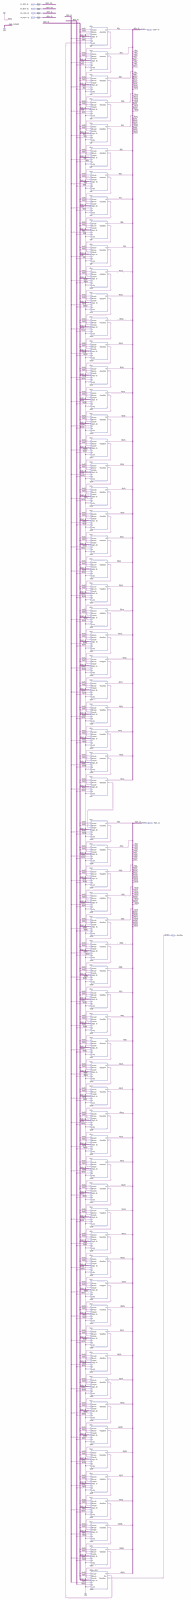
[diagram p0: schematic sheet, whole]
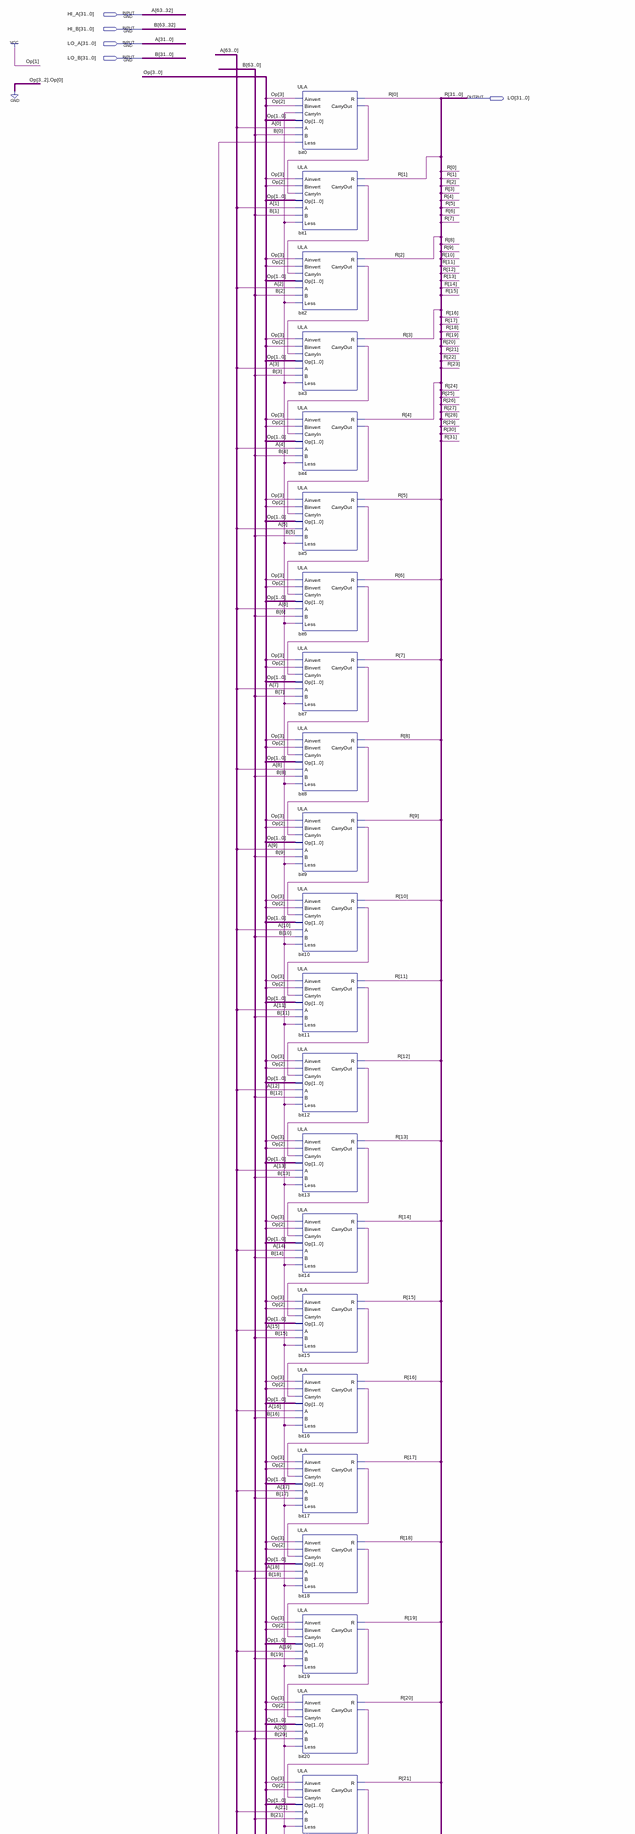
[diagram p1: schematic sheet, upper part]
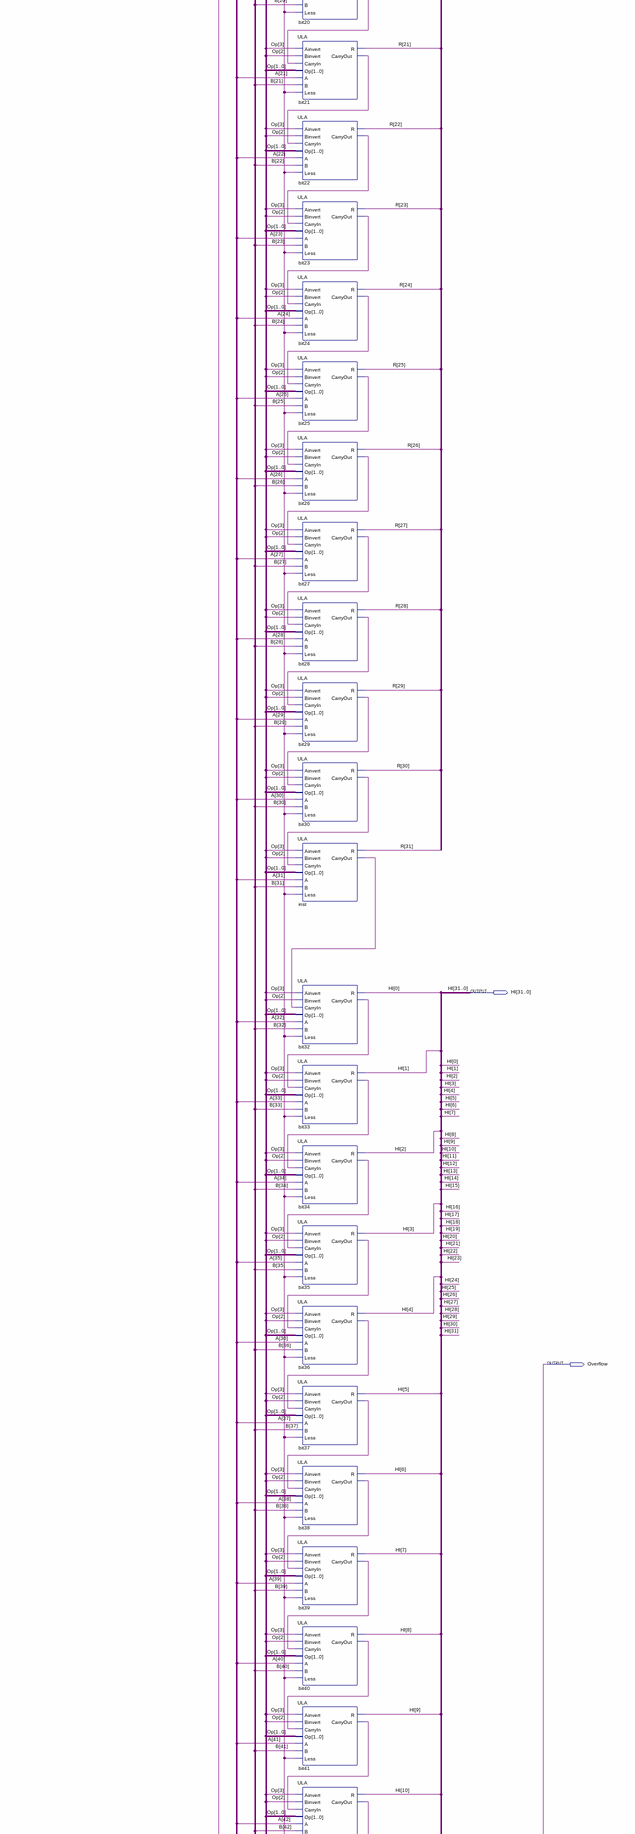
[diagram p2: schematic sheet, middle part]
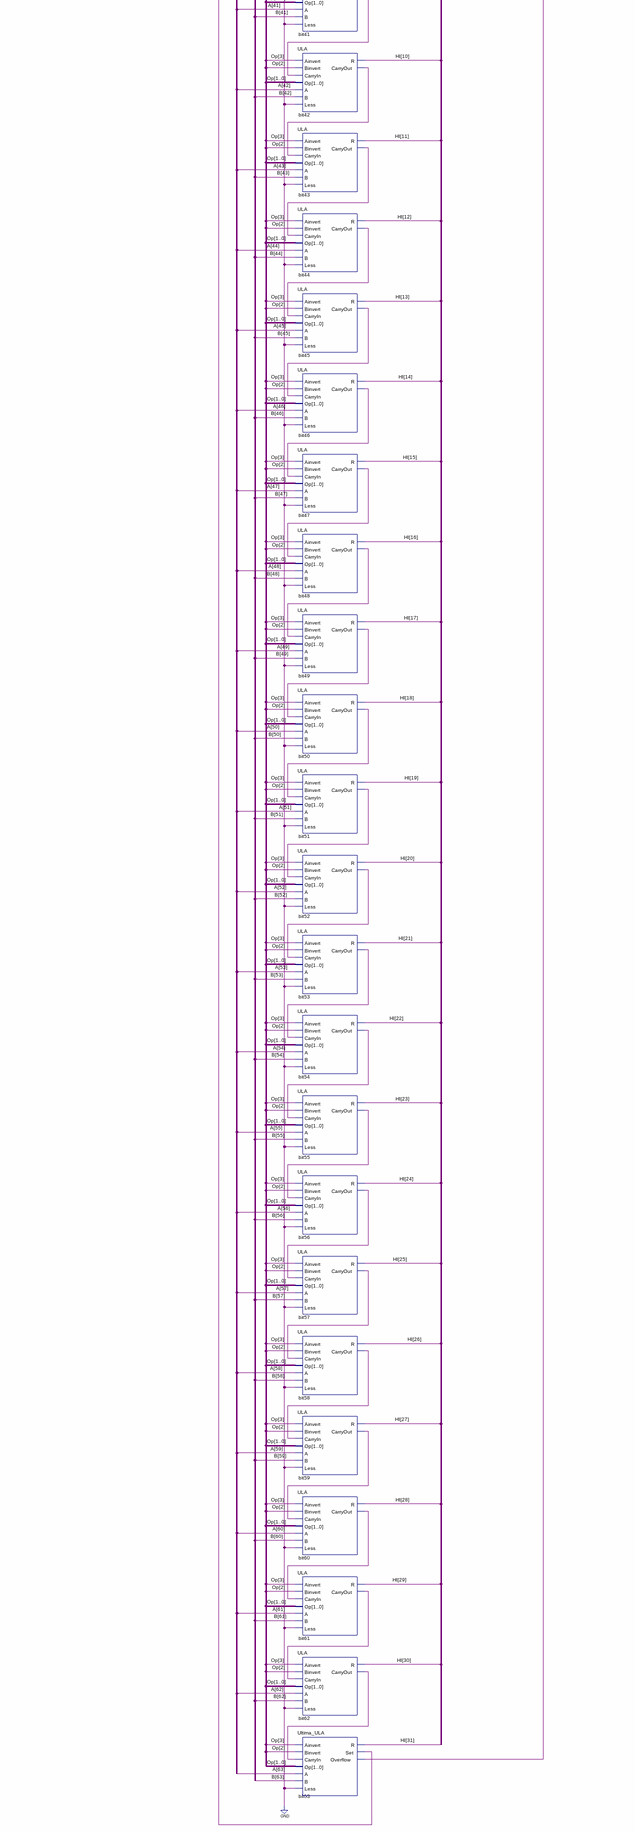
[diagram p3: schematic sheet, lower part]
// Quartus schematic ULA64.bdf as structural Verilog: 64 symbols, 7 pins
module ULA64 (
  input  [31:0] HI_A,
  input  [31:0] HI_B,
  input  [31:0] LO_A,
  input  [31:0] LO_B,
  output [31:0] LO,
  output [31:0] HI,
  output Overflow
);

  wire bit0_carryout, bit1_carryout, bit2_carryout, bit3_carryout, bit4_carryout, bit5_carryout,
       bit6_carryout, bit7_carryout, bit8_carryout, bit9_carryout, bit10_carryout, bit11_carryout,
       bit12_carryout, bit13_carryout, bit14_carryout, bit15_carryout, bit16_carryout, bit17_carryout,
       bit18_carryout, bit19_carryout, bit20_carryout, bit21_carryout, bit22_carryout, bit23_carryout,
       bit24_carryout, bit25_carryout, bit26_carryout, bit27_carryout, bit28_carryout, bit29_carryout,
       bit30_carryout, bit32_carryout, bit33_carryout, bit34_carryout, bit35_carryout, bit36_carryout,
       bit37_carryout, bit38_carryout, bit39_carryout, bit40_carryout, bit41_carryout, bit42_carryout,
       bit43_carryout, bit44_carryout, bit45_carryout, bit46_carryout, bit47_carryout, bit48_carryout,
       bit49_carryout, bit50_carryout, bit51_carryout, bit52_carryout, bit53_carryout, bit54_carryout,
       bit55_carryout, bit56_carryout, bit57_carryout, bit58_carryout, bit59_carryout, bit60_carryout,
       bit61_carryout, bit62_carryout, bit63_set, inst_carryout;

  ULA bit0 (
    .Ainvert(1'b0), .Binvert(1'b0), .CarryIn(1'b0), .Op(2'b10), .A(LO_A[0]), .B(LO_B[0]), .Less(bit63_set),
    .R(LO[0]), .CarryOut(bit0_carryout));
  ULA bit1 (
    .Ainvert(1'b0), .Binvert(1'b0), .CarryIn(bit0_carryout), .Op(2'b10), .A(LO_A[1]), .B(LO_B[1]),
    .Less(1'b0), .R(LO[1]), .CarryOut(bit1_carryout));
  ULA bit2 (
    .Ainvert(1'b0), .Binvert(1'b0), .CarryIn(bit1_carryout), .Op(2'b10), .A(LO_A[2]), .B(LO_B[2]),
    .Less(1'b0), .R(LO[2]), .CarryOut(bit2_carryout));
  ULA bit3 (
    .Ainvert(1'b0), .Binvert(1'b0), .CarryIn(bit2_carryout), .Op(2'b10), .A(LO_A[3]), .B(LO_B[3]),
    .Less(1'b0), .R(LO[3]), .CarryOut(bit3_carryout));
  ULA bit4 (
    .Ainvert(1'b0), .Binvert(1'b0), .CarryIn(bit3_carryout), .Op(2'b10), .A(LO_A[4]), .B(LO_B[4]),
    .Less(1'b0), .R(LO[4]), .CarryOut(bit4_carryout));
  ULA bit5 (
    .Ainvert(1'b0), .Binvert(1'b0), .CarryIn(bit4_carryout), .Op(2'b10), .A(LO_A[5]), .B(LO_B[5]),
    .Less(1'b0), .R(LO[5]), .CarryOut(bit5_carryout));
  ULA bit6 (
    .Ainvert(1'b0), .Binvert(1'b0), .CarryIn(bit5_carryout), .Op(2'b10), .A(LO_A[6]), .B(LO_B[6]),
    .Less(1'b0), .R(LO[6]), .CarryOut(bit6_carryout));
  ULA bit7 (
    .Ainvert(1'b0), .Binvert(1'b0), .CarryIn(bit6_carryout), .Op(2'b10), .A(LO_A[7]), .B(LO_B[7]),
    .Less(1'b0), .R(LO[7]), .CarryOut(bit7_carryout));
  ULA bit8 (
    .Ainvert(1'b0), .Binvert(1'b0), .CarryIn(bit7_carryout), .Op(2'b10), .A(LO_A[8]), .B(LO_B[8]),
    .Less(1'b0), .R(LO[8]), .CarryOut(bit8_carryout));
  ULA bit9 (
    .Ainvert(1'b0), .Binvert(1'b0), .CarryIn(bit8_carryout), .Op(2'b10), .A(LO_A[9]), .B(LO_B[9]),
    .Less(1'b0), .R(LO[9]), .CarryOut(bit9_carryout));
  ULA bit10 (
    .Ainvert(1'b0), .Binvert(1'b0), .CarryIn(bit9_carryout), .Op(2'b10), .A(LO_A[10]), .B(LO_B[10]),
    .Less(1'b0), .R(LO[10]), .CarryOut(bit10_carryout));
  ULA bit11 (
    .Ainvert(1'b0), .Binvert(1'b0), .CarryIn(bit10_carryout), .Op(2'b10), .A(LO_A[11]), .B(LO_B[11]),
    .Less(1'b0), .R(LO[11]), .CarryOut(bit11_carryout));
  ULA bit12 (
    .Ainvert(1'b0), .Binvert(1'b0), .CarryIn(bit11_carryout), .Op(2'b10), .A(LO_A[12]), .B(LO_B[12]),
    .Less(1'b0), .R(LO[12]), .CarryOut(bit12_carryout));
  ULA bit13 (
    .Ainvert(1'b0), .Binvert(1'b0), .CarryIn(bit12_carryout), .Op(2'b10), .A(LO_A[13]), .B(LO_B[13]),
    .Less(1'b0), .R(LO[13]), .CarryOut(bit13_carryout));
  ULA bit14 (
    .Ainvert(1'b0), .Binvert(1'b0), .CarryIn(bit13_carryout), .Op(2'b10), .A(LO_A[14]), .B(LO_B[14]),
    .Less(1'b0), .R(LO[14]), .CarryOut(bit14_carryout));
  ULA bit15 (
    .Ainvert(1'b0), .Binvert(1'b0), .CarryIn(bit14_carryout), .Op(2'b10), .A(LO_A[15]), .B(LO_B[15]),
    .Less(1'b0), .R(LO[15]), .CarryOut(bit15_carryout));
  ULA bit16 (
    .Ainvert(1'b0), .Binvert(1'b0), .CarryIn(bit15_carryout), .Op(2'b10), .A(LO_A[16]), .B(LO_B[16]),
    .Less(1'b0), .R(LO[16]), .CarryOut(bit16_carryout));
  ULA bit17 (
    .Ainvert(1'b0), .Binvert(1'b0), .CarryIn(bit16_carryout), .Op(2'b10), .A(LO_A[17]), .B(LO_B[17]),
    .Less(1'b0), .R(LO[17]), .CarryOut(bit17_carryout));
  ULA bit18 (
    .Ainvert(1'b0), .Binvert(1'b0), .CarryIn(bit17_carryout), .Op(2'b10), .A(LO_A[18]), .B(LO_B[18]),
    .Less(1'b0), .R(LO[18]), .CarryOut(bit18_carryout));
  ULA bit19 (
    .Ainvert(1'b0), .Binvert(1'b0), .CarryIn(bit18_carryout), .Op(2'b10), .A(LO_A[19]), .B(LO_B[19]),
    .Less(1'b0), .R(LO[19]), .CarryOut(bit19_carryout));
  ULA bit20 (
    .Ainvert(1'b0), .Binvert(1'b0), .CarryIn(bit19_carryout), .Op(2'b10), .A(LO_A[20]), .B(LO_B[20]),
    .Less(1'b0), .R(LO[20]), .CarryOut(bit20_carryout));
  ULA bit21 (
    .Ainvert(1'b0), .Binvert(1'b0), .CarryIn(bit20_carryout), .Op(2'b10), .A(LO_A[21]), .B(LO_B[21]),
    .Less(1'b0), .R(LO[21]), .CarryOut(bit21_carryout));
  ULA bit22 (
    .Ainvert(1'b0), .Binvert(1'b0), .CarryIn(bit21_carryout), .Op(2'b10), .A(LO_A[22]), .B(LO_B[22]),
    .Less(1'b0), .R(LO[22]), .CarryOut(bit22_carryout));
  ULA bit23 (
    .Ainvert(1'b0), .Binvert(1'b0), .CarryIn(bit22_carryout), .Op(2'b10), .A(LO_A[23]), .B(LO_B[23]),
    .Less(1'b0), .R(LO[23]), .CarryOut(bit23_carryout));
  ULA bit24 (
    .Ainvert(1'b0), .Binvert(1'b0), .CarryIn(bit23_carryout), .Op(2'b10), .A(LO_A[24]), .B(LO_B[24]),
    .Less(1'b0), .R(LO[24]), .CarryOut(bit24_carryout));
  ULA bit25 (
    .Ainvert(1'b0), .Binvert(1'b0), .CarryIn(bit24_carryout), .Op(2'b10), .A(LO_A[25]), .B(LO_B[25]),
    .Less(1'b0), .R(LO[25]), .CarryOut(bit25_carryout));
  ULA bit26 (
    .Ainvert(1'b0), .Binvert(1'b0), .CarryIn(bit25_carryout), .Op(2'b10), .A(LO_A[26]), .B(LO_B[26]),
    .Less(1'b0), .R(LO[26]), .CarryOut(bit26_carryout));
  ULA bit27 (
    .Ainvert(1'b0), .Binvert(1'b0), .CarryIn(bit26_carryout), .Op(2'b10), .A(LO_A[27]), .B(LO_B[27]),
    .Less(1'b0), .R(LO[27]), .CarryOut(bit27_carryout));
  ULA bit28 (
    .Ainvert(1'b0), .Binvert(1'b0), .CarryIn(bit27_carryout), .Op(2'b10), .A(LO_A[28]), .B(LO_B[28]),
    .Less(1'b0), .R(LO[28]), .CarryOut(bit28_carryout));
  ULA bit29 (
    .Ainvert(1'b0), .Binvert(1'b0), .CarryIn(bit28_carryout), .Op(2'b10), .A(LO_A[29]), .B(LO_B[29]),
    .Less(1'b0), .R(LO[29]), .CarryOut(bit29_carryout));
  ULA bit30 (
    .Ainvert(1'b0), .Binvert(1'b0), .CarryIn(bit29_carryout), .Op(2'b10), .A(LO_A[30]), .B(LO_B[30]),
    .Less(1'b0), .R(LO[30]), .CarryOut(bit30_carryout));
  ULA inst (
    .Ainvert(1'b0), .Binvert(1'b0), .CarryIn(bit30_carryout), .Op(2'b10), .A(LO_A[31]), .B(LO_B[31]),
    .Less(1'b0), .R(LO[31]), .CarryOut(inst_carryout));
  ULA bit32 (
    .Ainvert(1'b0), .Binvert(1'b0), .CarryIn(inst_carryout), .Op(2'b10), .A(HI_A[0]), .B(HI_B[0]),
    .Less(1'b0), .R(HI[0]), .CarryOut(bit32_carryout));
  ULA bit33 (
    .Ainvert(1'b0), .Binvert(1'b0), .CarryIn(bit32_carryout), .Op(2'b10), .A(HI_A[1]), .B(HI_B[1]),
    .Less(1'b0), .R(HI[1]), .CarryOut(bit33_carryout));
  ULA bit34 (
    .Ainvert(1'b0), .Binvert(1'b0), .CarryIn(bit33_carryout), .Op(2'b10), .A(HI_A[2]), .B(HI_B[2]),
    .Less(1'b0), .R(HI[2]), .CarryOut(bit34_carryout));
  ULA bit35 (
    .Ainvert(1'b0), .Binvert(1'b0), .CarryIn(bit34_carryout), .Op(2'b10), .A(HI_A[3]), .B(HI_B[3]),
    .Less(1'b0), .R(HI[3]), .CarryOut(bit35_carryout));
  ULA bit36 (
    .Ainvert(1'b0), .Binvert(1'b0), .CarryIn(bit35_carryout), .Op(2'b10), .A(HI_A[4]), .B(HI_B[4]),
    .Less(1'b0), .R(HI[4]), .CarryOut(bit36_carryout));
  ULA bit37 (
    .Ainvert(1'b0), .Binvert(1'b0), .CarryIn(bit36_carryout), .Op(2'b10), .A(HI_A[5]), .B(HI_B[5]),
    .Less(1'b0), .R(HI[5]), .CarryOut(bit37_carryout));
  ULA bit38 (
    .Ainvert(1'b0), .Binvert(1'b0), .CarryIn(bit37_carryout), .Op(2'b10), .A(HI_A[6]), .B(HI_B[6]),
    .Less(1'b0), .R(HI[6]), .CarryOut(bit38_carryout));
  ULA bit39 (
    .Ainvert(1'b0), .Binvert(1'b0), .CarryIn(bit38_carryout), .Op(2'b10), .A(HI_A[7]), .B(HI_B[7]),
    .Less(1'b0), .R(HI[7]), .CarryOut(bit39_carryout));
  ULA bit40 (
    .Ainvert(1'b0), .Binvert(1'b0), .CarryIn(bit39_carryout), .Op(2'b10), .A(HI_A[8]), .B(HI_B[8]),
    .Less(1'b0), .R(HI[8]), .CarryOut(bit40_carryout));
  ULA bit41 (
    .Ainvert(1'b0), .Binvert(1'b0), .CarryIn(bit40_carryout), .Op(2'b10), .A(HI_A[9]), .B(HI_B[9]),
    .Less(1'b0), .R(HI[9]), .CarryOut(bit41_carryout));
  ULA bit42 (
    .Ainvert(1'b0), .Binvert(1'b0), .CarryIn(bit41_carryout), .Op(2'b10), .A(HI_A[10]), .B(HI_B[10]),
    .Less(1'b0), .R(HI[10]), .CarryOut(bit42_carryout));
  ULA bit43 (
    .Ainvert(1'b0), .Binvert(1'b0), .CarryIn(bit42_carryout), .Op(2'b10), .A(HI_A[11]), .B(HI_B[11]),
    .Less(1'b0), .R(HI[11]), .CarryOut(bit43_carryout));
  ULA bit44 (
    .Ainvert(1'b0), .Binvert(1'b0), .CarryIn(bit43_carryout), .Op(2'b10), .A(HI_A[12]), .B(HI_B[12]),
    .Less(1'b0), .R(HI[12]), .CarryOut(bit44_carryout));
  ULA bit45 (
    .Ainvert(1'b0), .Binvert(1'b0), .CarryIn(bit44_carryout), .Op(2'b10), .A(HI_A[13]), .B(HI_B[13]),
    .Less(1'b0), .R(HI[13]), .CarryOut(bit45_carryout));
  ULA bit46 (
    .Ainvert(1'b0), .Binvert(1'b0), .CarryIn(bit45_carryout), .Op(2'b10), .A(HI_A[14]), .B(HI_B[14]),
    .Less(1'b0), .R(HI[14]), .CarryOut(bit46_carryout));
  ULA bit47 (
    .Ainvert(1'b0), .Binvert(1'b0), .CarryIn(bit46_carryout), .Op(2'b10), .A(HI_A[15]), .B(HI_B[15]),
    .Less(1'b0), .R(HI[15]), .CarryOut(bit47_carryout));
  ULA bit48 (
    .Ainvert(1'b0), .Binvert(1'b0), .CarryIn(bit47_carryout), .Op(2'b10), .A(HI_A[16]), .B(HI_B[16]),
    .Less(1'b0), .R(HI[16]), .CarryOut(bit48_carryout));
  ULA bit49 (
    .Ainvert(1'b0), .Binvert(1'b0), .CarryIn(bit48_carryout), .Op(2'b10), .A(HI_A[17]), .B(HI_B[17]),
    .Less(1'b0), .R(HI[17]), .CarryOut(bit49_carryout));
  ULA bit50 (
    .Ainvert(1'b0), .Binvert(1'b0), .CarryIn(bit49_carryout), .Op(2'b10), .A(HI_A[18]), .B(HI_B[18]),
    .Less(1'b0), .R(HI[18]), .CarryOut(bit50_carryout));
  ULA bit51 (
    .Ainvert(1'b0), .Binvert(1'b0), .CarryIn(bit50_carryout), .Op(2'b10), .A(HI_A[19]), .B(HI_B[19]),
    .Less(1'b0), .R(HI[19]), .CarryOut(bit51_carryout));
  ULA bit52 (
    .Ainvert(1'b0), .Binvert(1'b0), .CarryIn(bit51_carryout), .Op(2'b10), .A(HI_A[20]), .B(HI_B[20]),
    .Less(1'b0), .R(HI[20]), .CarryOut(bit52_carryout));
  ULA bit53 (
    .Ainvert(1'b0), .Binvert(1'b0), .CarryIn(bit52_carryout), .Op(2'b10), .A(HI_A[21]), .B(HI_B[21]),
    .Less(1'b0), .R(HI[21]), .CarryOut(bit53_carryout));
  ULA bit54 (
    .Ainvert(1'b0), .Binvert(1'b0), .CarryIn(bit53_carryout), .Op(2'b10), .A(HI_A[22]), .B(HI_B[22]),
    .Less(1'b0), .R(HI[22]), .CarryOut(bit54_carryout));
  ULA bit55 (
    .Ainvert(1'b0), .Binvert(1'b0), .CarryIn(bit54_carryout), .Op(2'b10), .A(HI_A[23]), .B(HI_B[23]),
    .Less(1'b0), .R(HI[23]), .CarryOut(bit55_carryout));
  ULA bit56 (
    .Ainvert(1'b0), .Binvert(1'b0), .CarryIn(bit55_carryout), .Op(2'b10), .A(HI_A[24]), .B(HI_B[24]),
    .Less(1'b0), .R(HI[24]), .CarryOut(bit56_carryout));
  ULA bit57 (
    .Ainvert(1'b0), .Binvert(1'b0), .CarryIn(bit56_carryout), .Op(2'b10), .A(HI_A[25]), .B(HI_B[25]),
    .Less(1'b0), .R(HI[25]), .CarryOut(bit57_carryout));
  ULA bit58 (
    .Ainvert(1'b0), .Binvert(1'b0), .CarryIn(bit57_carryout), .Op(2'b10), .A(HI_A[26]), .B(HI_B[26]),
    .Less(1'b0), .R(HI[26]), .CarryOut(bit58_carryout));
  ULA bit59 (
    .Ainvert(1'b0), .Binvert(1'b0), .CarryIn(bit58_carryout), .Op(2'b10), .A(HI_A[27]), .B(HI_B[27]),
    .Less(1'b0), .R(HI[27]), .CarryOut(bit59_carryout));
  ULA bit60 (
    .Ainvert(1'b0), .Binvert(1'b0), .CarryIn(bit59_carryout), .Op(2'b10), .A(HI_A[28]), .B(HI_B[28]),
    .Less(1'b0), .R(HI[28]), .CarryOut(bit60_carryout));
  ULA bit61 (
    .Ainvert(1'b0), .Binvert(1'b0), .CarryIn(bit60_carryout), .Op(2'b10), .A(HI_A[29]), .B(HI_B[29]),
    .Less(1'b0), .R(HI[29]), .CarryOut(bit61_carryout));
  ULA bit62 (
    .Ainvert(1'b0), .Binvert(1'b0), .CarryIn(bit61_carryout), .Op(2'b10), .A(HI_A[30]), .B(HI_B[30]),
    .Less(1'b0), .R(HI[30]), .CarryOut(bit62_carryout));
  Ultima_ULA bit63 (
    .Ainvert(1'b0), .Binvert(1'b0), .CarryIn(bit62_carryout), .Op(2'b10), .A(HI_A[31]), .B(HI_B[31]),
    .Less(1'b0), .R(HI[31]), .Set(bit63_set), .Overflow(Overflow));

  // Other names for the same wires on the sheet: A[63:0] = {HI_A, LO_A}; B[63:0] = {HI_B, LO_B}; R[31:0] = LO
endmodule
